# Altium schematic sheet [8] USB.SchDoc
size A4
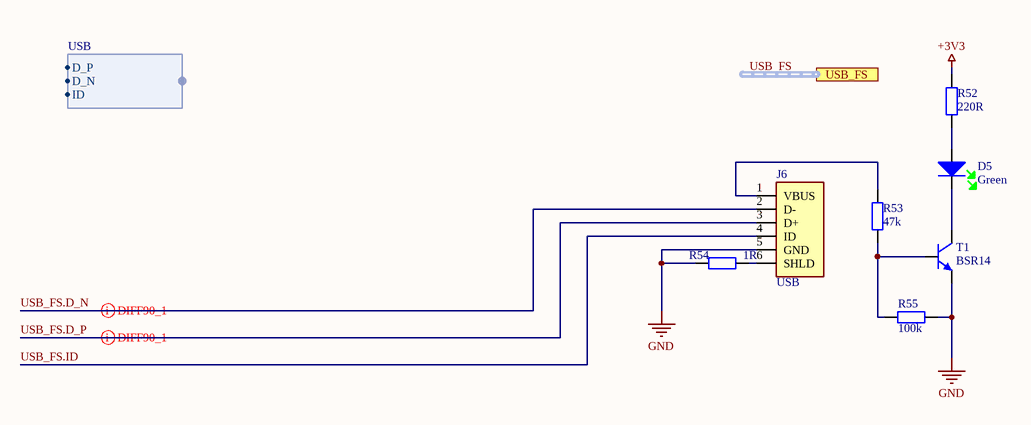
[diagram p0: [8] USB.SchDoc]

## Parts
D5  Green  [LED 0805 Green]
J6  USB  [Mechanical microUSB 47590-0001]
R52  220R  [Resistor 0603]
R53  47k  [Resistor 0603]
R54  1R  [Resistor 0603]
R55  100k  [Resistor 0603]
T1  BSR14  [SOT23-3]

## Ports
USB_FS (harness USB)

## Harnesses
USB: D_P, D_N, ID

## Nets
+3V3: R52.2
GND: J6.5(GND) R54.1 R55.2 T1.3
USB_FS.D_N: J6.2(D-)
USB_FS.D_P: J6.3(D+)
USB_FS.ID: J6.4(ID)
NetD5_1: D5.1 T1.2
NetD5_2: D5.2 R52.1
NetJ6_1: J6.1(VBUS) R53.2
NetJ6_6: J6.6(SHLD) R54.2
NetR53_1: R53.1 R55.1 T1.1

## Buses and harness runs
harness USB_FS = port USB_FS

## Layout directives
differential pair; differential pair class USB: USB_FS.D_N, USB_FS.D_P

## Library data of the parts
D5 = Diode Standard LEDs - SMD 0805 Dome Lens LED Green- 570nm APTD2012LCGCK: Standard LEDs - SMD 0805 Dome Lens LED Green- 570nm; Manufacturer: Kingbright; Manufacturer Part Number: APTD2012LCGCK; Footprint: 0805; Type: SMD; Datasheet: https://pl.mouser.com/datasheet/2/216/APTD2012LCGCK-1102037.pdf
J6 = Mechanical USB Connectors MICRO USB AB RECPT RA SMT TOP MNT ASSY: USB Connectors MICRO USB AB RECPT RA SMT TOP MNT ASSY; Manufacturer Part Number: 47590-0001; Manufacturer: Molex; Footprint: 5 Contact; Type: SMD/THT; Datasheet: https://pl.mouser.com/datasheet/2/276/0475900001_IO_CONNECTORS-704847.pdf
R52 = Resistor 220R 1% 0603 RT0603FRE07220RL: Thin Film Resistors - SMD 1/10W 220 ohm 1% 50ppm; Manufacturer: Yageo; Manufacturer Part Number: RT0603FRE07220RL; Footprint: 0603; Type: SMD; Datasheet: https://pl.mouser.com/datasheet/2/447/PYu_RT_1_to_0_01_RoHS_L_11-1669912.pdf
R53 = Resistor 47k 1% 0603 RT0603FRE0747KL: Thin Film Resistors - SMD 1/10W 47K ohm 1% 50ppm; Manufacturer: Yageo; Manufacturer Part Number: RT0603FRE0747KL; Footprint: 0603; Type: SMD; Datasheet: https://pl.mouser.com/datasheet/2/447/PYu_RT_1_to_0_01_RoHS_L_11-1669912.pdf
R54 = Resistor 1R 1% 0603 RT0603FRE071RL: Thin Film Resistors - SMD 1/10W 1 ohm ohm 50 ppm; Manufacturer: Yageo; Manufacturer Part Number: RT0603FRE071RL; Footprint: 0603; Type: SMD; Datasheet: https://pl.mouser.com/datasheet/2/447/PYu_RT_1_to_0_01_RoHS_L_11-1669912.pdf
R55 = Resistor 100k 1% 0603 RT0603FRE07100KL: Thin Film Resistors - SMD 100K ohm 1% 1/10W; Manufacturer: Yageo; Manufacturer Part Number: RT0603FRE07100KL; Footprint: 0603; Type: SMD; Datasheet: https://pl.mouser.com/datasheet/2/447/PYu_RT_1_to_0_01_RoHS_L_11-1669912.pdf
T1 = Transistor Bipolar Transistor - BJT NPN Transistor General Purpose: Bipolar Transistors - BJT NPN Transistor General Purpose; Manufacturer: ON Semiconductor / Fairchild; Type: SMD; Manufacturer Part Number: BSR14; Footprint: SOT-23-3; Datasheet: https://pl.mouser.com/datasheet/2/308/BSR14-D-1802416.pdf